# EAGLE design arduino (EAGLE 6.4)
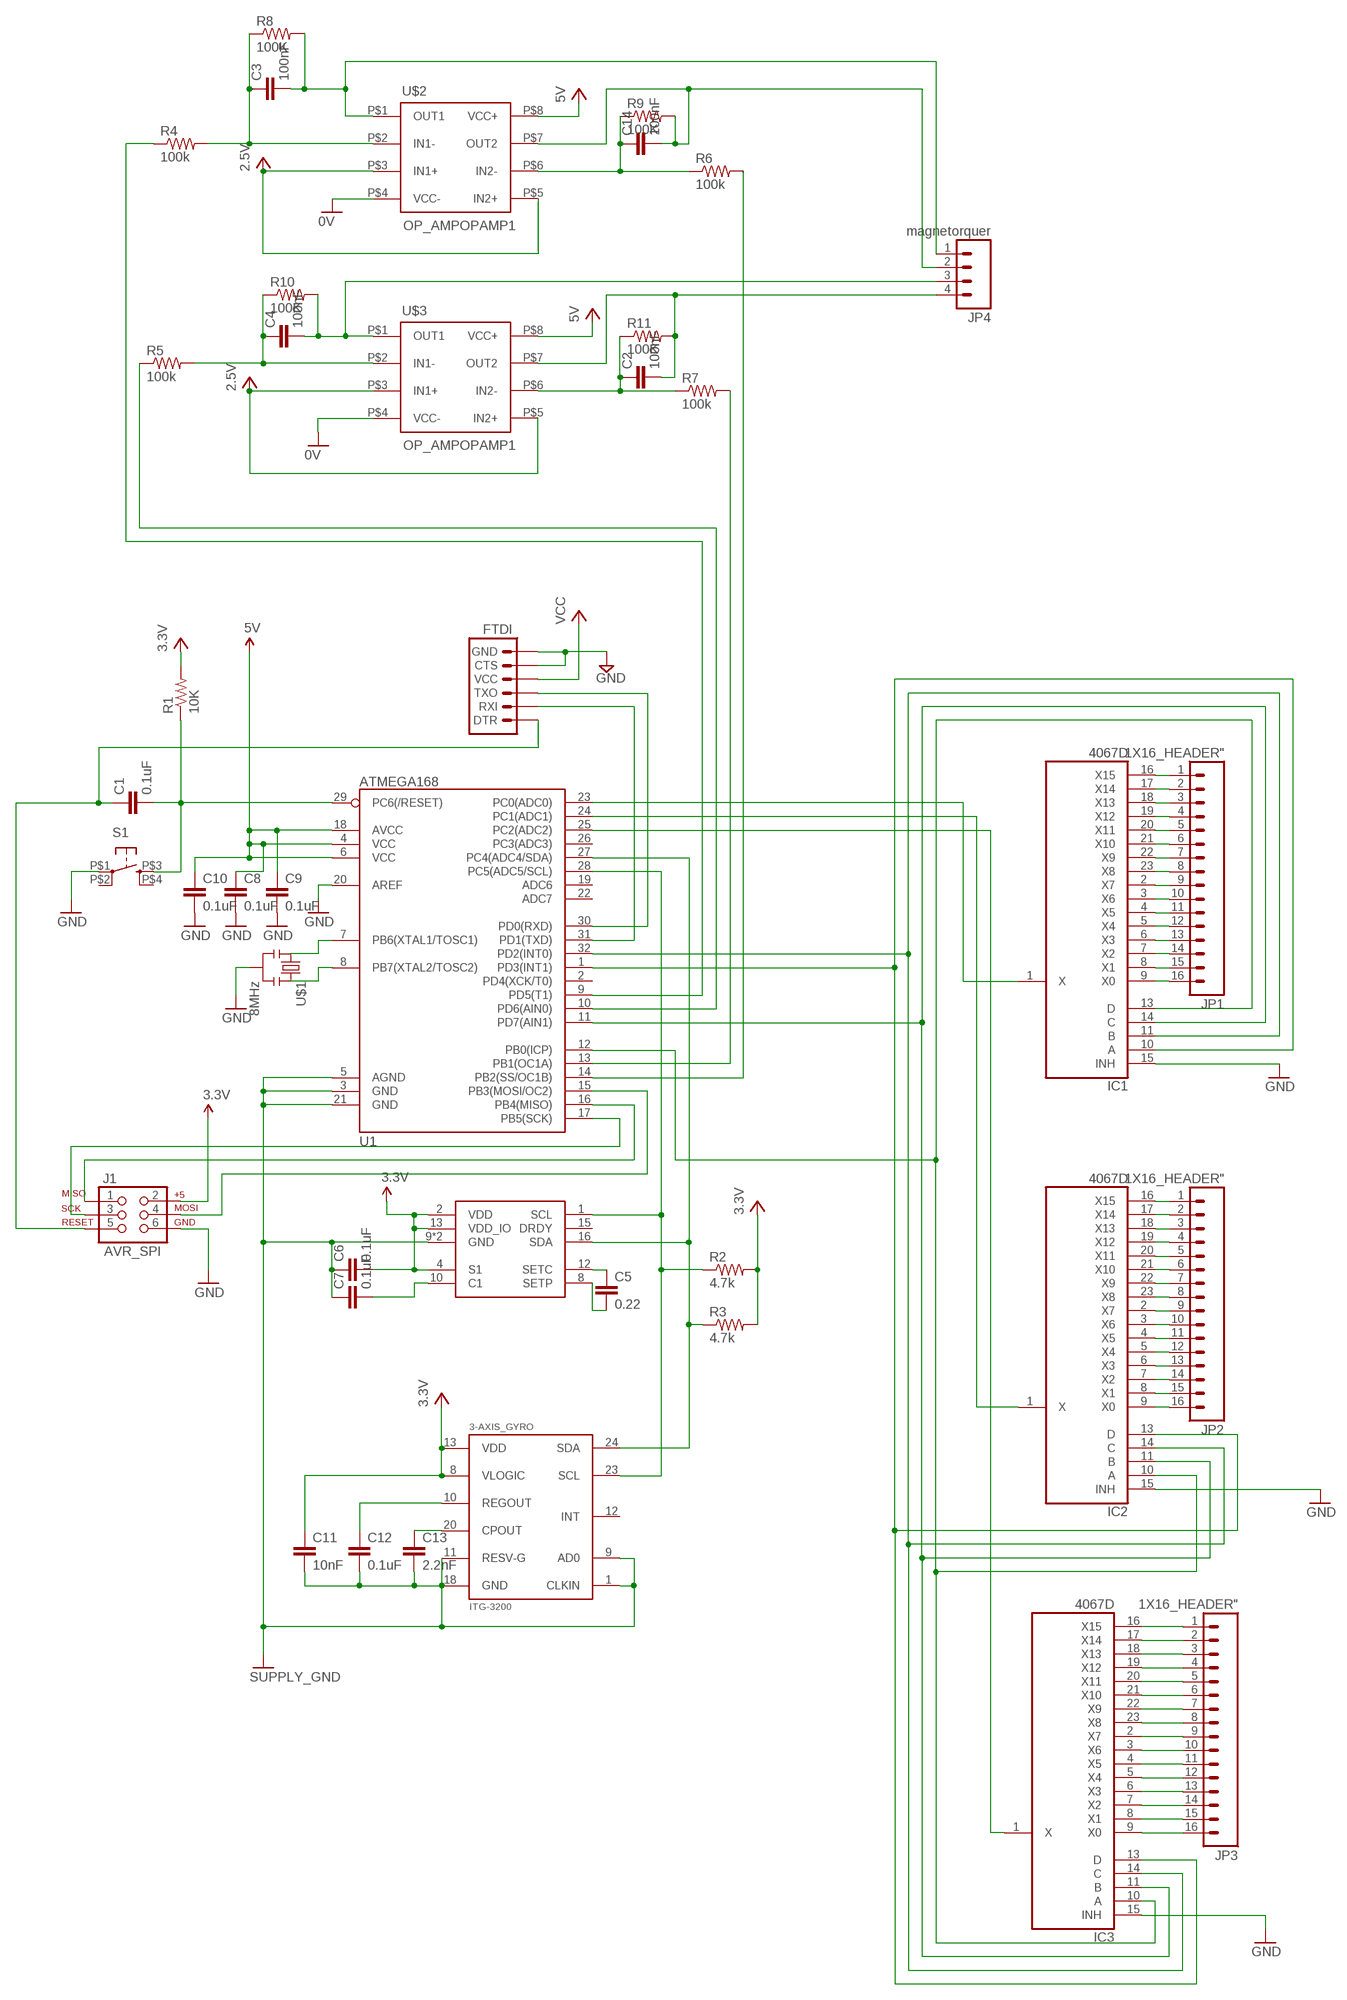
[diagram p0: schematic, sheet 1]

## Parts
3-AXIS_GYRO  ITG-3200  [QFN-24]
3-AXIS_MAG  HMC5883L  [LPCC16]
C1  0.1uF  CAP0603-CAP  [0603-CAP]
C2  100nF  CAP0402-CAP  [0402-CAP]
C3  100nF  CAP0402-CAP  [0402-CAP]
C4  100nF  CAP0402-CAP  [0402-CAP]
C5  0.22  CAP0402-CAP  [0402-CAP]
C6  0.1uF  CAP0402-CAP  [0402-CAP]
C7  0.1uF  CAP0402-CAP  [0402-CAP]
C8  0.1uF  CAP0603-CAP  [0603-CAP]
C9  0.1uF  CAP0603-CAP  [0603-CAP]
C10  0.1uF  CAP0603-CAP  [0603-CAP]
C11  10nF  CAP0402-CAP  [0402-CAP]
C12  0.1uF  CAP0402-CAP  [0402-CAP]
C13  2.2nF  CAP0402-CAP  [0402-CAP]
C14  100nF  CAP0402-CAP  [0402-CAP]
FTDI  ARDUINO_SERIAL_PROGRAMPTH  [1X06]
IC1  4067D  [SO24W]
IC2  4067D  [SO24W]
IC3  4067D  [SO24W]
J1  AVR_SPI  AVR_SPI_PRG_6PTH  [2X3]
JP1  1X16_HEADER"  [1X16_HEADER]
JP2  1X16_HEADER"  [1X16_HEADER]
JP3  1X16_HEADER"  [1X16_HEADER]
JP4  magnetorquer  1X04_HEADER"  [1X04_HEADER]
R1  10K  RESISTOR  [0805]
R2  4.7k  RESISTOR  [0805]
R3  4.7k  RESISTOR  [0805]
R4  100k  RESISTOR  [0805]
R5  100k  RESISTOR  [0805]
R6  100k  RESISTOR  [0805]
R7  100k  RESISTOR  [0805]
R8  100K  RESISTOR  [0805]
R9  100K  RESISTOR  [0805]
R10  100K  RESISTOR  [0805]
R11  100K  RESISTOR  [0805]
S1  TAC_SWITCHKSA_SEALED  [KSA_SEALED_TAC_SWITCH]
U1  ATMEGA168  [TQFP32-08]
U$1  8MHz  RESONATOR"  [RESONATOR]
U$2  OP_AMPOPAMP1  [OPAMP]
U$3  OP_AMPOPAMP1  [OPAMP]

## Nets
GND: 3-AXIS_GYRO.1(CLKIN) 3-AXIS_GYRO.9(AD0) 3-AXIS_GYRO.11(RESV-G) 3-AXIS_GYRO.18(GND) 3-AXIS_MAG.9(GND) 3-AXIS_MAG.11(GND) C6.1 C7.1 C8.2 C9.2 C10.2 C11.2 C12.2 C13.2 FTDI.5(CTS) FTDI.6(GND) IC1.15(INH) IC2.15(INH) IC3.15(INH) J1.6 S1.P$1 U1.3(GND) U1.5(AGND) U1.20(AREF) U1.21(GND) U$1.2 U$2.P$4(VCC-) U$3.P$4(VCC-) ; supply symbol labelled SUPPLY_GND, 0V
N$1: IC1.16(X15) JP1.1
N$2: IC1.14(C) IC2.11(B) IC3.11(B) U1.11(PD7(AIN1))
N$3: IC1.11(B) IC2.14(C) IC3.14(C) U1.32(PD2(INT0))
N$4: IC1.10(A) IC2.13(D) IC3.13(D) U1.1(PD3(INT1))
N$5: IC1.1(X) U1.23(PC0(ADC0))
N$6: IC2.1(X) U1.24(PC1(ADC1))
N$7: IC1.13(D) IC2.10(A) IC3.10(A) U1.12(PB0(ICP))
N$8: IC1.17(X14) JP1.2
N$9: IC1.18(X13) JP1.3
N$10: IC1.19(X12) JP1.4
N$11: IC1.20(X11) JP1.5
N$12: IC1.21(X10) JP1.6
N$13: IC1.22(X9) JP1.7
N$14: IC1.23(X8) JP1.8
N$15: IC1.2(X7) JP1.9
N$16: IC1.3(X6) JP1.10
N$17: IC1.4(X5) JP1.11
N$18: IC1.5(X4) JP1.12
N$19: IC1.6(X3) JP1.13
N$20: IC1.7(X2) JP1.14
N$21: IC1.8(X1) JP1.15
N$22: IC1.9(X0) JP1.16
N$23: IC2.16(X15) JP2.1
N$24: IC2.17(X14) JP2.2
N$25: IC2.18(X13) JP2.3
N$26: IC2.19(X12) JP2.4
N$27: IC2.20(X11) JP2.5
N$28: IC2.21(X10) JP2.6
N$29: IC2.22(X9) JP2.7
N$30: IC2.23(X8) JP2.8
N$31: IC2.2(X7) JP2.9
N$32: IC2.3(X6) JP2.10
N$33: IC2.4(X5) JP2.11
N$34: IC2.5(X4) JP2.12
N$35: IC2.6(X3) JP2.13
N$36: IC2.7(X2) JP2.14
N$37: IC2.8(X1) JP2.15
N$38: IC2.9(X0) JP2.16
N$39: C1.1 FTDI.1(DTR) J1.5
N$40: C1.2 R1.1 S1.P$3 U1.29(PC6(/RESET))
N$41: 3-AXIS_GYRO.23(SCL) 3-AXIS_MAG.1(SCL) R2.1 U1.28(PC5(ADC5/SCL))
N$42: IC3.1(X) U1.25(PC2(ADC2))
N$43: 3-AXIS_GYRO.24(SDA) 3-AXIS_MAG.16(SDA) R3.1 U1.27(PC4(ADC4/SDA))
N$44: 3-AXIS_MAG.12(SETC) C5.1
N$45: 3-AXIS_MAG.8(SETP) C5.2
N$46: IC3.16(X15) JP3.1
N$47: IC3.17(X14) JP3.2
N$48: IC3.18(X13) JP3.3
N$49: IC3.19(X12) JP3.4
N$50: IC3.20(X11) JP3.5
N$51: IC3.21(X10) JP3.6
N$52: IC3.22(X9) JP3.7
N$53: IC3.23(X8) JP3.8
N$54: IC3.2(X7) JP3.9
N$55: IC3.3(X6) JP3.10
N$56: IC3.4(X5) JP3.11
N$57: IC3.5(X4) JP3.12
N$58: IC3.6(X3) JP3.13
N$59: IC3.7(X2) JP3.14
N$60: IC3.8(X1) JP3.15
N$61: IC3.9(X0) JP3.16
N$62: 3-AXIS_MAG.10(C1) C7.2
N$63: R5.1 U1.10(PD6(AIN0))
N$64: 3-AXIS_GYRO.20(CPOUT) C13.1
N$65: 3-AXIS_GYRO.10(REGOUT) C12.1
N$66: C3.2 JP4.1 R8.2 U$2.P$1(OUT1)
N$67: J1.1 U1.16(PB4(MISO))
N$68: J1.3 U1.17(PB5(SCK))
N$69: U1.7(PB6(XTAL1/TOSC1)) U$1.1
N$70: U1.8(PB7(XTAL2/TOSC2)) U$1.3
N$71: J1.4 U1.15(PB3(MOSI/OC2))
N$72: R7.2 U1.13(PB1(OC1A))
N$73: R4.1 U1.9(PD5(T1))
N$75: R6.2 U1.14(PB2(SS/OC1B))
N$76: C4.1 R5.2 R10.1 U$3.P$2(IN1-)
N$77: C14.1 R6.1 R9.1 U$2.P$6(IN2-)
N$78: C2.1 R7.1 R11.1 U$3.P$6(IN2-)
N$79: C4.2 JP4.3 R10.2 U$3.P$1(OUT1)
N$80: FTDI.3(TXO) U1.30(PD0(RXD))
N$81: FTDI.2(RXI) U1.31(PD1(TXD))
N$83: C2.2 JP4.4 R11.2 U$3.P$7(OUT2)
N$84: C3.1 R4.2 R8.1 U$2.P$2(IN1-)
N$85: C14.2 JP4.2 R9.2 U$2.P$7(OUT2)
VCC: 3-AXIS_GYRO.8(VLOGIC) 3-AXIS_GYRO.13(VDD) 3-AXIS_MAG.2(VDD) 3-AXIS_MAG.4(S1) 3-AXIS_MAG.13(VDD_IO) C6.2 C8.1 C9.1 C10.1 C11.1 FTDI.4(VCC) J1.2 R1.2 R2.2 R3.2 U1.4(VCC) U1.6(VCC) U1.18(AVCC) U$2.P$3(IN1+) U$2.P$5(IN2+) U$2.P$8(VCC+) U$3.P$3(IN1+) U$3.P$5(IN2+) U$3.P$8(VCC+) ; supply symbol labelled 3.3V, 5V, 2.5V
Unconnected: 3-AXIS_GYRO.12(INT) 3-AXIS_MAG.15(DRDY) S1.P$2 S1.P$4 U1.2(PD4(XCK/T0)) U1.19(ADC6) U1.22(ADC7) U1.26(PC3(ADC3))

## Power pins joined to a net without a drawn wire
VDD: IC1.24(VDD) IC2.24(VDD) IC3.24(VDD)
VSS: IC1.12(VSS) IC2.12(VSS) IC3.12(VSS)

## Library data of the parts
3-AXIS_GYRO = SparkFun:ITG-3200: ITG-3200 3-axis gyro, digital output, qfn24 package
3-AXIS_MAG = HMC5883L:HMC5883L
C1-C14 = SparkFun:CAP: Capacitor Standard 0603 ceramic capacitor, and 0.1" leaded capacitor.
FTDI = SparkFun:ARDUINO_SERIAL_PROGRAM
IC1-IC3 = 40xx:4067: 16-channel ANALOG MULTIPLEXER
J1 = SparkFun:AVR_SPI_PRG_6: AVR ISP 6 Pin This is the reduced ISP connector for AVR programming. Common on Arduino. This footprint will take up less PCB space and can be used with a 10-pin to 6-pin adapter such as SKU: BOB-08508
JP1-JP3 = RBBB:1X16_HEADER
JP4 = RBBB:1X04_HEADER: Header 4 Standard 4-pin 0.1" header. Use with straight break away headers (SKU : PRT-00116), right angle break away headers (PRT-00553), swiss pins (PRT-00743), machine pins (PRT-00117), and female headers (PRT-00115). Molex polarized connector foot print use with SKU : PRT-08231 with associated crimp pins and housings.
R1-R11 = SparkFun:RESISTOR: Resistor Basic schematic elements and footprints for 0603, 1206, and PTH 1/10th watt (small) resistors.
S1 = SparkFun:TAC_SWITCH: Momentary Switch Button commonly used for reset or general input. Spark Fun Electronics SKU : COM-00097
U1 = SparkFun:ATMEGA168
U$1 = RBBB:RESONATOR: Resonator Small SMD resonator. This is the itty bitty 10/20MHz resonators with built in caps. CSTCE10M0G55 and CSTCE20M0V53. Footprint has been reviewed closely but hasn t been tested yet.'
U$2 U$3 = watsat:OP_AMP

## Board
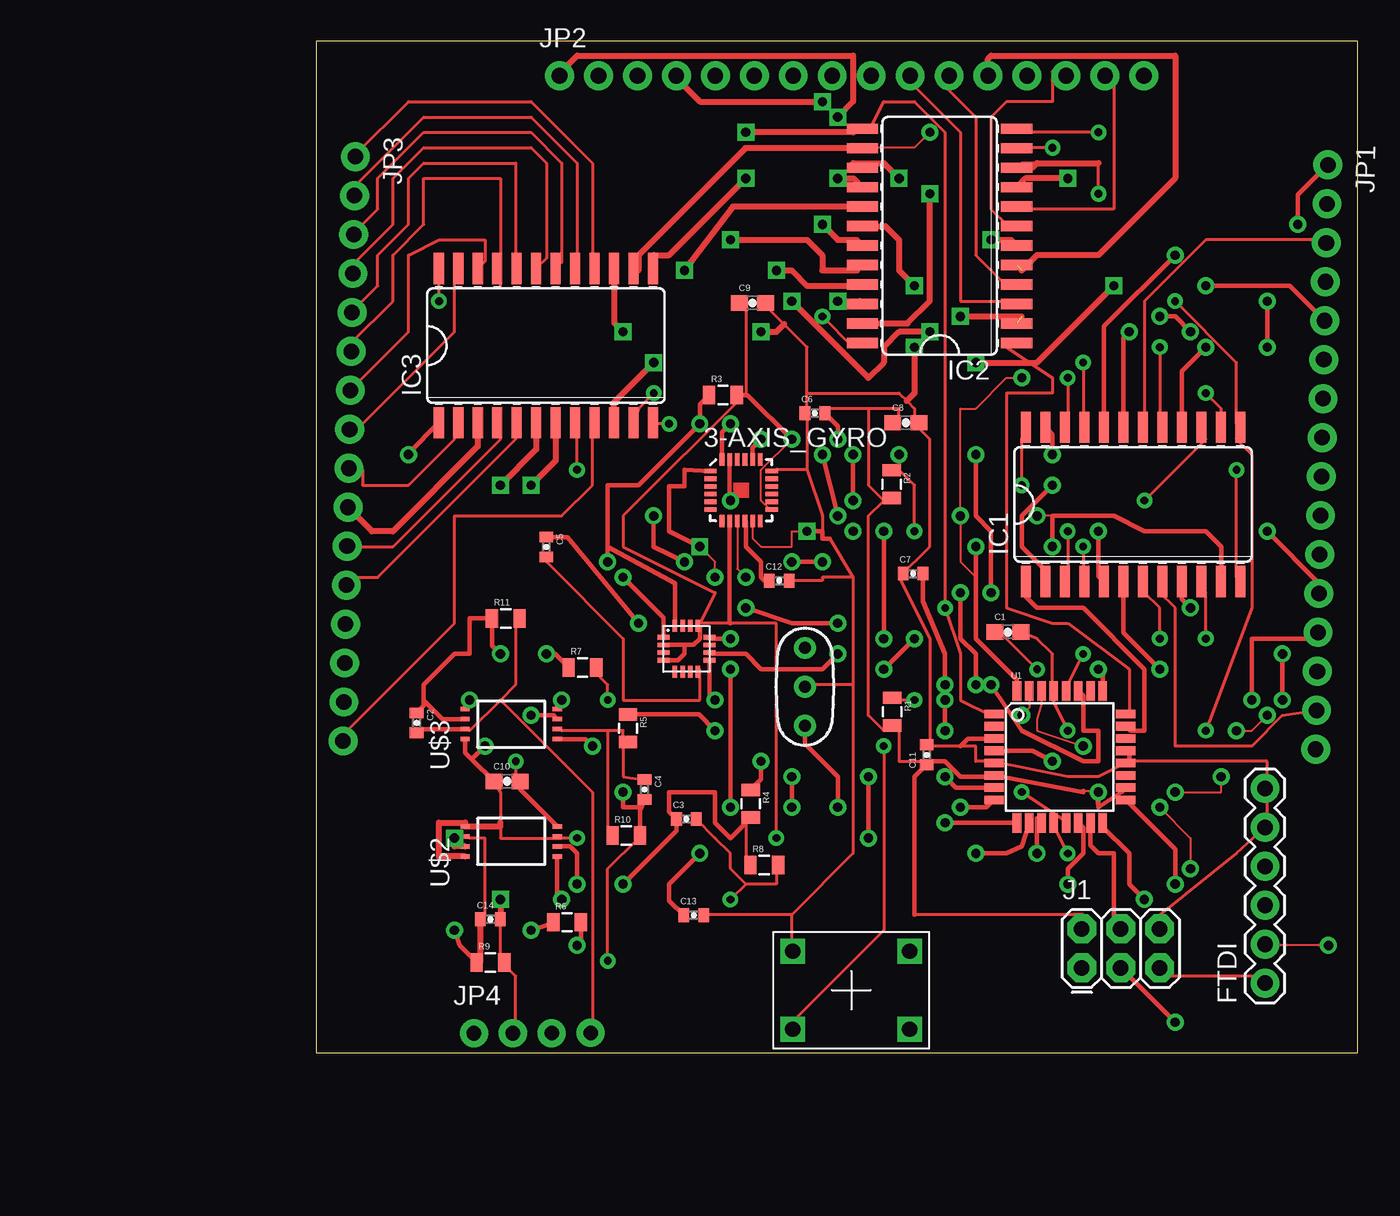
[diagram p1: board, top side]
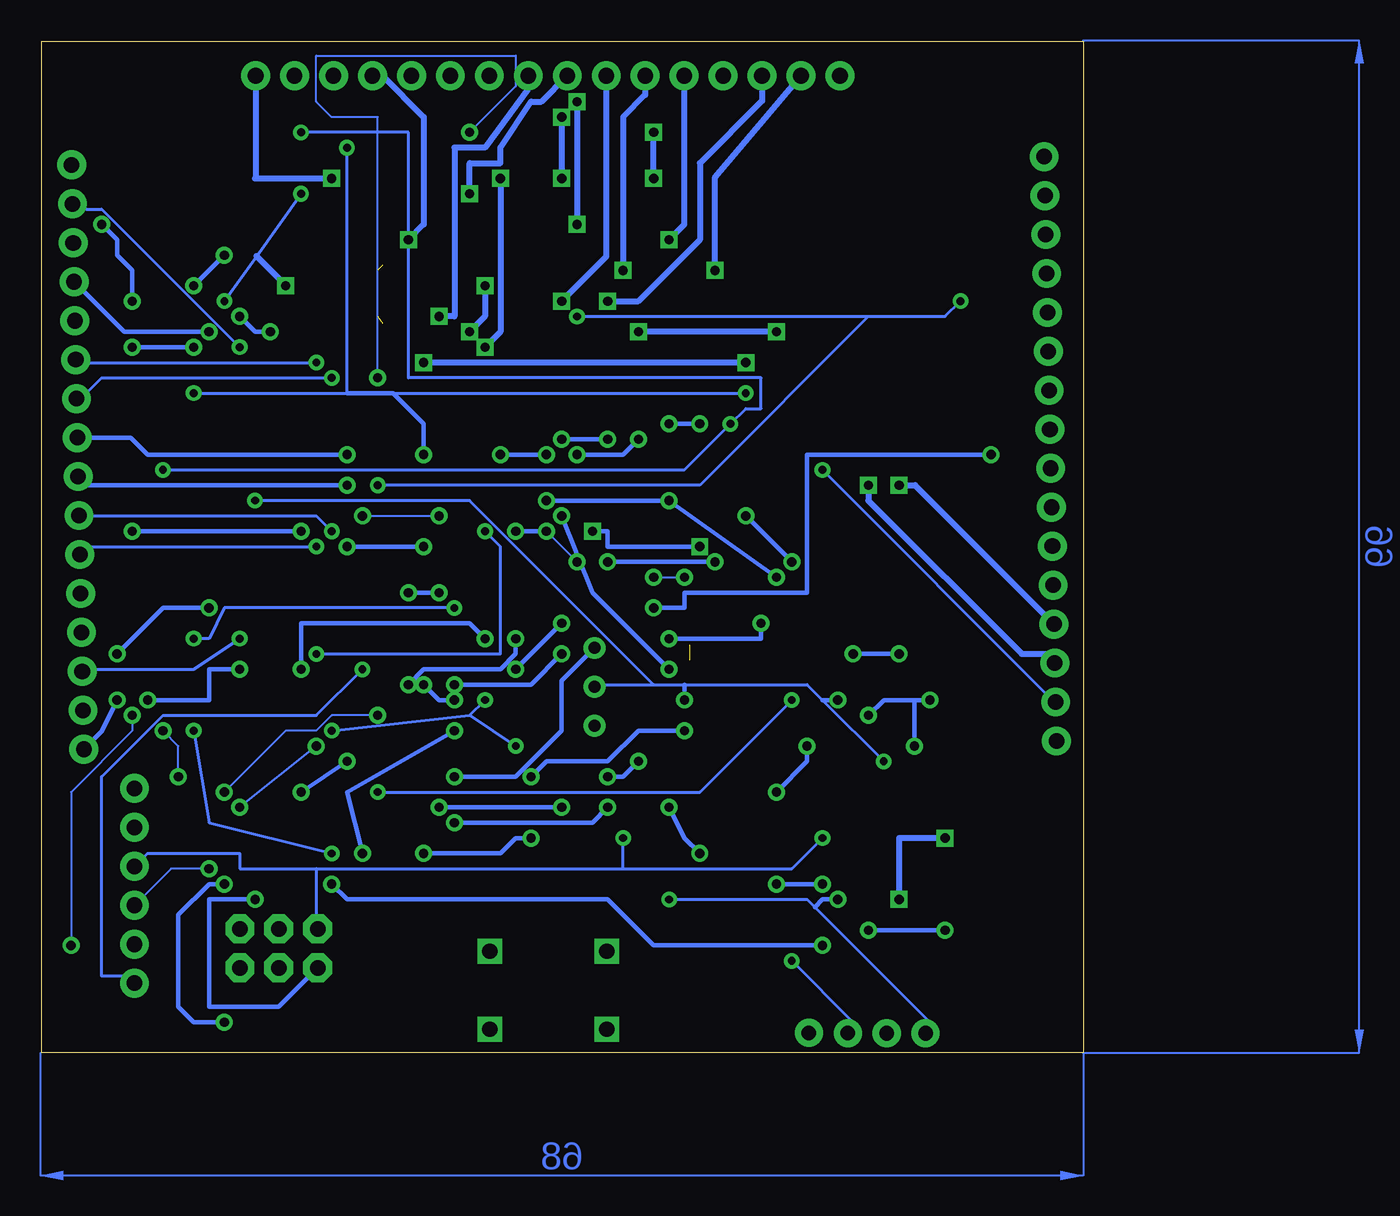
[diagram p2: board, bottom side, seen from below]

Size 67.9 x 65.95 mm. Coordinates in mm from the lower left corner, seen from the top.
Outline: 0,0 67.9,0 67.9,65.95 0,65.95 0,0
Copper layers (1*16): Top 0.035mm / dielectric 1.5mm / Bottom 0.035mm
Design rules "SparkFun *": minimum track width 8mil, minimum drill 20mil, track to track 8mil, track to pad 8mil, pad to pad 8mil, via to via 8mil, smd to smd 8mil, copper to edge 10mil, drill to drill 8mil, minimum pad ring 12mil, minimum via ring 10mil, stop-mask expansion 4mil, vias tented up to drill 25mil, thermal gap 10mil

### Footprints (pad centres in the part's own frame; a part is rotated, then mirrored left to right if it is on the bottom)
QFN-24 = smd 0.8 x 0.3: 1 -2,1.25; 2 -2,0.75; 3 -2,0.25; 4 -2,-0.25; 5 -2,-0.75; 6 -2,-1.25; 13 2,-1.25; 14 2,-0.75; 15 2,-0.25; 16 2,0.25; 17 2,0.75; 18 2,1.25 | smd 0.3 x 0.8: 7 -1.25,-2; 8 -0.75,-2; 9 -0.25,-2; 10 0.25,-2; 11 0.75,-2; 12 1.25,-2; 19 1.25,2; 20 0.75,2; 21 0.25,2; 22 -0.25,2; 23 -0.75,2; 24 -1.25,2
LPCC16 = smd 0.8 x 0.3: 1 -1.5,0.75; 2 -1.5,0.25; 3 -1.5,-0.25; 4 -1.5,-0.75; 9 1.5,-0.75; 10 1.5,-0.25; 11 1.5,0.25; 12 1.5,0.75 | smd 0.3 x 0.8: 5 -0.75,-1.5; 6 -0.25,-1.5; 7 0.25,-1.5; 8 0.75,-1.5; 13 0.75,1.5; 14 0.25,1.5; 15 -0.25,1.5; 16 -0.75,1.5
0603-CAP = smd 1.1 x 1: 1 -0.85,0; 2 0.85,0
0402-CAP = smd 0.7 x 0.9: 1 -0.65,0; 2 0.65,0
1X06 = drill 1.016 pad 1.88: 1 0,0; 2 2.54,0; 3 5.08,0; 4 7.62,0; 5 10.16,0; 6 12.7,0
SO24W = smd 0.66 x 2.032: 1 -6.985,-5.029; 2 -5.715,-5.029; 3 -4.445,-5.029; 4 -3.175,-5.029; 5 -1.905,-5.029; 6 -0.635,-5.029; 7 0.635,-5.029; 8 1.905,-5.029; 9 3.175,-5.029; 10 4.445,-5.029; 11 5.715,-5.029; 12 6.985,-5.029; 13 6.985,5.029; 14 5.715,5.029; 15 4.445,5.029; 16 3.175,5.029; 17 1.905,5.029; 18 0.635,5.029; 19 -0.635,5.029; 20 -1.905,5.029; 21 -3.175,5.029; 22 -4.445,5.029; 23 -5.715,5.029; 24 -6.985,5.029
2X3 = drill 1.016 pad 1.88 octagon: 1 0,0; 2 0,2.54; 3 2.54,0; 4 2.54,2.54; 5 5.08,0; 6 5.08,2.54
1X16_HEADER = drill 1.016 pad 1.88: 1 0,0; 2 2.54,0; 3 5.08,0; 4 7.62,0; 5 10.16,0; 6 12.7,0; 7 15.24,0; 8 17.78,0; 9 20.32,0; 10 22.86,0; 11 25.4,0; 12 27.94,0; 13 30.48,0; 14 33.02,0; 15 35.56,0; 16 38.1,0
1X04_HEADER = drill 0.965 pad 1.829: 1 0,0; 2 2.54,0; 3 5.08,0; 4 7.62,0
0805 = smd 0.8 x 1.2: 1 -0.9,0; 2 0.9,0
KSA_SEALED_TAC_SWITCH = drill 1 square: P$1 -3.81,2.54; P$2 3.81,2.54; P$3 -3.81,-2.54; P$4 3.81,-2.54
TQFP32-08 = smd 1.27 x 0.559: 1 -4.293,2.8; 2 -4.293,2; 3 -4.293,1.2; 4 -4.293,0.4; 5 -4.293,-0.4; 6 -4.293,-1.2; 7 -4.293,-2; 8 -4.293,-2.8; 17 4.293,-2.8; 18 4.293,-2; 19 4.293,-1.2; 20 4.293,-0.4; 21 4.293,0.4; 22 4.293,1.2; 23 4.293,2; 24 4.293,2.8 | smd 0.559 x 1.27: 9 -2.8,-4.293; 10 -2,-4.293; 11 -1.2,-4.293; 12 -0.4,-4.293; 13 0.4,-4.293; 14 1.2,-4.293; 15 2,-4.293; 16 2.8,-4.293; 25 2.8,4.293; 26 2,4.293; 27 1.2,4.293; 28 0.4,4.293; 29 -0.4,4.293; 30 -1.2,4.293; 31 -2,4.293; 32 -2.8,4.293
RESONATOR = drill 0.8: 1 -2.54,0; 2 0,0; 3 2.54,0
OPAMP = smd 0.305 x 0.61: P$1 -0.975,-3; P$2 -0.325,-3; P$3 0.325,-3; P$4 0.975,-3; P$5 0.975,3; P$6 0.325,3; P$7 -0.325,3; P$8 -0.975,3

### Placement (x,y rotation side)
3-AXIS_GYRO  27.7,36.67 0 top
3-AXIS_MAG  24.13,26.34 0 top
C1  45.1,27.43 0 top
C2  6.54,21.51 270 top
C3  24.13,15.24 0 top
C4  21.4,17.16 270 top
C5  14.99,32.97 270 top
C6  32.51,41.69 0 top
C7  38.91,31.24 0 top
C8  38.43,41.07 0 top
C9  28.43,48.88 0 top
C10  12.43,17.69 0 top
C11  39.8,19.43 90 top
C12  30.18,30.78 0 top
C13  24.61,8.97 0 top
C14  11.35,8.7 0 top
FTDI  61.86,4.54 90 top
IC1  53.26,35.75 0 top
IC2  40.64,53.26 90 top
IC3  14.97,46.1 0 top
J1  49.91,5.54 0 top
JP1  65.96,57.88 268.8 top
JP2  15.86,63.69 0 top
JP3  2.54,58.42 268.8 top
JP4  10.27,1.27 0.2 top
R1  37.56,22.24 270 top
R2  37.51,37.07 270 top
R3  26.51,42.88 0 top
R4  28.32,16.24 270 top
R5  20.32,21.16 270 top
R6  16.35,8.51 0 top
R7  17.35,25.13 0 top
R8  29.21,12.24 0 top
R9  11.35,5.89 0 top
R10  20.21,14.16 0 top
R11  12.35,28.32 0 top
S1  34.88,4.08 0 top
U1  48.48,19.29 0 top
U$1  31.86,23.86 270 top
U$2  12.7,13.78 90 top
U$3  12.7,21.43 90 top

### Tracks (layer width: path | path; a pad name or v marks a point on that pad's centre or on a via)
GND  (via drill 0.51, 0.6)  (1 unrouted)
  Top 0.14: 3-AXIS_GYRO.9 27.45,31.55 v28,31 | v26,31 26,32 v25,33 | 3-AXIS_GYRO.11 28.45,33.55 29,33 31,33 31,34 v32,34
  Top 0.203: v13,19 13,18 C10.2 | v54,36 58,40 IC1.15 | 40,20 40,27 38,31 | 39,41 40,40 40,33 38,31 | 38,31 C7.1 | 53,19 51,18 49,18 44,19 | J1.6 55,9 60,13 FTDI.5 62,15 62,17 FTDI.6 62,18 62,19 53,19 | 53,19 U1.20 | 40,20 42,20 43,20 43,19 44,19 | 40,20 C11.2 | 44,19 U1.5 | 31,9 25,9 C13.2 | 31,9 31,7 S1.P$1 | 32,39 32,38 | 32,38 30,38 3-AXIS_GYRO.18 | 32,42 32,39 | 33,34 33,35 32,38 | 32,39 32,38 | 32,42 32,43 | 32,43 32,46 30.5,47.5 29,49 C9.2 | 32,42 C6.1 | 35,58 IC2.15 | 31,9 35,13 35,24 | 35,31 35,24 | 35,31 33,31 33,30.78 C12.2 | 39,41 39,42 38.5,42.5 38,43 32,43 | 39,41 C8.2 | 35,24 32,24 U$1.2 | 33.5,33.5 35,31
  Top 0.3: U$3.P$4 15.7,22.7 v16,23 | C10.2 13.28,17.18 U$2.P$4 | U1.3 42.49,20.49 42,20 | 53,19 53,19.46 U1.21 | 3-AXIS_MAG.9 25.63,23.37 v26,23
  Top 0.305: 3-AXIS_GYRO.1 24,38 24,36.92 23,36.92 23,34 v25,33 | v32,34 33,34 33,33.5 33.5,33.5
  Top 0.406: IC3.15 19.41,47.59 v20,47 | v29,47 30,47 30.5,47.5 | 35,58 37,58 v38,57 | v39,46 39,43 38.5,42.5
  Bottom 0.14: v28,31 v26,31
  Bottom 0.203: v13,19 17,23 18,24 26,24 28,24 | 28,24 32,24 U$1.2 | v54,36 40,36 28,24
  Bottom 0.3: v16,23 17,23 | v26,23 26,24
  Bottom 0.305: v25,33 31,33 31,34 v32,34
  Bottom 0.406: v20,47 v29,47 | v38,57 38,47 v39,46
N$1  (via drill 0.6)
  Top 0.3: IC1.16 56.44,44.44 v58,46 | v62,46 v62,49 | v64,54 64,55.92 JP1.1
  Bottom 0.3: v58,46 v62,46 | v62,49 62,51 63,52 63,53 v64,54
N$2  (via drill 0.51, 0.6)
  Top 0.203: v22,43 21,42 IC3.11 | v58,43 59,42 59,41 IC1.14 | v48,59 46,59 IC2.11
  Top 0.3: v43,39 43,35 44,34 v44,30 | v42,30 42,27 43,26 v43,24 | v41,23 v41,21 | v47,13 47,15.28 U1.11
  Bottom 0.203: v58,43 48,43 | 48,43 v22,43 | 48,43 v48,59
  Bottom 0.3: 48,43 45,43 43,41 v43,39 | v44,30 v42,30 | v43,24 42,23 v41,23 | v41,21 48,17 v47,13
N$3  (via drill 0.6)
  Top 0.14: 48,35 v47,35 | 43,31 42,32 v42,35 42,42 43,42 45,44 v46,44 | v40,60 39,59 35.64,59 IC2.14
  Top 0.3: U1.32 45.68,24.32 43,27 43,31 v43,33 | v48,33 48,35 52,35 54,34 58,34 59,33 59,30 58.98,30.02 IC1.11
  Top 0.406: IC2.14 27.98,58.98 21,52 21,51 20.81,51 IC3.14
  Bottom 0.14: v47,35 v42,35 | v46,44 46,61 49,61 50,62 50,65 37,65 37,63 v40,60
  Bottom 0.3: v43,33 v48,33
N$4  (via drill 0.51, 0.6)
  Top 0.203: U1.1 44,22 42,23 42,26 v41,29 41,60 39,62 37,62 36,60 IC2.13 35,60 | 22,52 IC3.13 | v58,27 58,30 IC1.10
  Top 0.406: 35,60 v28,60 | 22,52 23,52 v28,57
  Bottom 0.203: v41,29 56,29 57,27 v58,27
  Bottom 0.406: v28,57 v28,60
N$5
  Top 0.3: IC1.1 46.27,29.73 47,29 50,29 54,25 54,21 53.06,21 U1.23
N$6
  Top 0.203: U1.24 53,22 53,25 49,28 48,28 45,29 45,43 48,43 48,44 45,46 IC2.1
N$7  (via drill 0.51, 0.6)
  Top 0.203: v49,13 48,15 U1.12 | v58,21 61,29 61,39 60,40 IC1.13 60,41 60,45 v56,49 | 47,58 46,58 IC2.10 | v51,56 51,58
  Top 0.406: IC2.10 46.7,57.7 47,58 51,58 | IC3.10 19.41,42.41 v22,45 | v43,45 47,45 v52,50
  Bottom 0.203: v58,21 57,15 v49,13 | v56,49 53.91,51.93 v51,56
  Bottom 0.406: v22,45 v43,45 | v52,50 52,50.03 53.91,51.93
N$8  (via drill 0.51)
  Top 0.203: v55,46 55,41 IC1.17
  Bottom 0.203: v55,46 64,55 65,55 JP1.2
N$9
  Top 0.203: IC1.18 54,41 54,49 58,53 65,53 JP1.3
N$10  (via drill 0.6)
  Top 0.3: IC1.19 52.62,46.62 v53,47 | v55,48 56,48 v57,47
  Bottom 0.3: v53,47 54,47 v55,48 | v57,47 62.54,47 JP1.4
N$11  (via drill 0.6)
  Top 0.3: IC1.20 51.35,47.35 v56,52 | v58,50 63.47,50 JP1.5
  Bottom 0.3: v56,52 v58,50
N$12  (via drill 0.51)
  Top 0.203: v50,45 50,41 IC1.21
  Bottom 0.203: v50,45 65,45 JP1.6
N$13  (via drill 0.51)
  Top 0.203: v49,44 49,41 IC1.22
  Bottom 0.203: v49,44 64,44 65,43 JP1.7
N$14  (via drill 0.6)
  Top 0.3: v48,39 48,40.32 IC1.23
  Bottom 0.3: JP1.8 62.1,40.1 61,39 v48,39
N$15  (via drill 0.6)
  Top 0.3: IC1.2 47.55,31.45 46,33 46,35 v48,37
  Bottom 0.3: v48,37 64.97,37 JP1.9
N$16  (via drill 0.51)
  Top 0.203: v49,34 49,31 IC1.3
  Bottom 0.203: v49,34 50,35 65,35 JP1.10
N$17  (via drill 0.51)
  Top 0.203: v50,33 50,31 IC1.4
  Bottom 0.203: v50,33 65,33 JP1.11
N$18  (via drill 0.6)
  Top 0.3: JP1.12 65.38,30.62 v62,34 | v51,34 51,31.08 IC1.5
  Bottom 0.3: v62,34 v51,34
N$19  (via drill 0.6)
  Top 0.3: IC1.6 52.62,27.38 v55,25 | v61,23 61,27 64.92,27 JP1.13
  Bottom 0.3: v55,25 57,25 57,23 v61,23
N$20  (via drill 0.51)
  Top 0.203: v55,27 55,29 54,30 IC1.7
  Bottom 0.203: v55,27 58,25 65,25 JP1.14
N$21
  Top 0.203: IC1.8 55,30 56,29 56,20 61,20 63,22 JP1.15
N$22  (via drill 0.6)
  Top 0.3: IC1.9 56.44,29.57 v57,29 | v63,26 v63,23
  Bottom 0.3: v57,29 60,29 v63,26 | v63,23 64,20.95 JP1.16
N$23  (via drill 0.6)
  Top 0.406: JP2.1 15.86,63.86 17,65 35,65 35,62 v34,61 | v34,57 35.05,57 IC2.16
  Bottom 0.406: v34,61 v34,57
N$24  (via drill 0.6)
  Top 0.406: IC2.17 27.16,55.16 v24,51
  Bottom 0.406: v24,51 24,57.09 JP2.2
N$25  (via drill 0.6)
  Top 0.406: IC2.18 37.1,53.9 38,53 38,51 v39,50 | v40,47 38,47 37,46 37,45 36,44 v31,49
  Bottom 0.406: JP2.3 20.94,62.06 25,58 25,53 29,49 v31,49 | v39,50 39,48 v40,47
N$26  (via drill 0.6)
  Top 0.406: JP2.4 23.48,63.52 25,62 v33,62 | v33,54 34,53 35.24,53 IC2.19
  Bottom 0.406: v33,62 v33,54
N$27  (via drill 0.6)
  Top 0.406: v27,53 32,53 33,52 33,51 35.26,51 IC2.20
  Bottom 0.406: JP2.5 26.02,53.98 v27,53
N$28  (via drill 0.6)
  Top 0.406: v30,51 31,51 32,50 35.53,50 IC2.21
  Bottom 0.406: JP2.6 28.56,62.44 30,61 v30,51
N$29  (via drill 0.6)
  Top 0.406: v34,49 35.43,49 IC2.22
  Bottom 0.406: JP2.7 31.1,51.9 v34,49
N$30  (via drill 0.6)
  Top 0.406: IC2.23 38.55,47.55 40,49 v40,56
  Bottom 0.406: v40,56 40,58 38,58 38,59 36,62 35.33,62 JP2.8
N$31  (via drill 0.6)  (1 unrouted)
  Top 0.406: v42,48 46,48
  Bottom 0.406: JP2.9 36.18,62.82 39,59 41,59 41,48 v42,48
N$32
  Top 0.203: IC2.3 45,49 42,49 42,60 39,63 JP2.10
N$33
  Top 0.203: IC2.4 45,50 43,52 43,61 41,63 JP2.11
N$34  (1 unrouted)
  Top 0.406: JP2.12 43.8,64.8 44,65 56,65 56,57 51,52 47,52 46,51
N$35  (via drill 0.6)
  Top 0.406: v44,53 45.29,53 IC2.6
  Bottom 0.406: JP2.13 45.69,63.69 43,61 43,54 v44,53
N$36
  Top 0.203: IC2.7 45,54 44,55 44,61 45,62 48,62 48,64 JP2.14
N$37
  Top 0.203: IC2.8 46,55 52,55 52,63 JP2.15
N$38  (via drill 0.6)
  Top 0.406: v49,57 46.23,57 IC2.9
  Bottom 0.406: JP2.16 53.96,57.04 54,57 v49,57
N$39  (via drill 0.51)
  Top 0.203: v47,25 45,27 C1.1 | J1.5 55,5 61,5 FTDI.1
  Bottom 0.203: v47,25 50,22 60,22 64,18 64,5 62,5 FTDI.1
N$40  (via drill 0.51)
  Top 0.203: C1.2 47,27 48,26 48,24 U1.29 48,23 v49,21 | v39,23 38,23 R1.1 | v37,20 37,8 31,2 S1.P$3
  Bottom 0.203: 40,22 v39,23 | v49,21 40,22 | 40,22 v37,20
N$41  (via drill 0.51, 0.6)
  Top 0.203: v39,34 39,37 38,38 R2.1 | v50,26 49,24 U1.28
  Top 0.3: 3-AXIS_GYRO.23 26.95,36.05 v27,36 | v35,36 v35,39 | v38,39 38,38 | 3-AXIS_MAG.1 22.63,28.37 v20,31
  Bottom 0.203: v39,34 38,33 38,26 v50,26
  Bottom 0.3: v35,36 v27,36 v20,31 | v35,39 v38,39
N$42  (via drill 0.6)
  Top 0.3: U1.25 51.28,24.72 v51,25 | v39,27 v37,25 | v34,28 31,28 v28,29 | v6,39 6,39.09 IC3.1
  Bottom 0.3: v51,25 51,28 40,28 v39,27 | v37,25 v34,28 | v28,29 26,29 26,30 18,30 18,39 v6,39
N$43  (via drill 0.6)
  Top 0.3: 3-AXIS_GYRO.24 26.45,40.45 v27,41 | R3.1 25,42.27 v25,41 21,37 19,37 19,33 | 3-AXIS_MAG.16 23.38,30.62 19,33 | 19,33 v19,32 | v22,35 22,33 v24,32 | v31,32 v33,32 | v37,34 v37,27 | v44,24 46,21 50,19 51,19 51,21 50,21 50,23.26 U1.27
  Bottom 0.14: v33,32 v35,34
  Bottom 0.3: v27,41 v25,41 | v19,32 v22,35 | v24,32 v31,32 | v35,34 v37,34 | v37,27 37,26 38,25 43,25 v44,24
N$44  (via drill 0.6)
  Top 0.3: C5.1 16.38,33.62 v21,28 | v27,27 25.72,27 3-AXIS_MAG.12
  Bottom 0.3: v21,28 21,27 v27,27
N$45
  Top 0.203: 3-AXIS_MAG.8 25,25 25,23 20,23 20,27 15,32 C5.2
N$46
  Top 0.2: JP3.1 2.54,58.54 6,62 14,62 18,58 18,51.27 IC3.16
N$47
  Top 0.2: JP3.2 2.49,56.49 7,61 14,61 17,58 17,51.25 IC3.17
N$48
  Top 0.2: JP3.3 2.43,53.43 4,55 4,57 7,60 14,60 16,58 16,51.52 IC3.18
N$49
  Top 0.2: JP3.4 2.38,51.38 5,54 5,57 7,59 14,59 15,58 15,51.79 IC3.19
N$50
  Top 0.2: JP3.5 2.33,48.33 4,50 4,52 6,54 6,57 7,58 13,58 13,51.19 IC3.20
N$51
  Top 0.2: JP3.6 2.27,46.27 5,49 5,52 7,54 7,57 12,57 12,50.92 | 12,50 12,50.92 | 12,50.92 IC3.21
N$52
  Top 0.2: JP3.7 2.22,43.22 6,47 6,52 8,53 11,53 11,51.6 IC3.22
N$53
  Top 0.203: IC3.23 9,51 9,47 3,41 JP3.8
N$54
  Top 0.203: IC3.2 9,41 9,40 6,37 3,37 3,38 JP3.9
N$55
  Top 0.406: IC3.3 10.53,39.52 5,34 3.63,34 JP3.10
N$56
  Top 0.203: IC3.4 12,41 12,40 5,33 2,33 JP3.11
N$57
  Top 0.203: IC3.5 13,41 13,40 4,31 2,31 JP3.12
N$58  (via drill 0.6)
  Top 0.406: IC3.6 14.34,39.34 v12,37
  Bottom 0.406: v12,37 10.96,37 JP3.13
N$59  (via drill 0.6)
  Top 0.406: IC3.7 15.61,38.6 v14,37
  Bottom 0.406: v14,37 14,36 4,26 2.44,26 JP3.14
N$60  (via drill 0.51)
  Top 0.203: v17,38 17,41 IC3.8
  Bottom 0.203: v17,38 2,23 JP3.15
N$61
  Top 0.203: IC3.9 18,41 18,37 16,35 9,35 9,28 2,21 JP3.16
N$62  (via drill 0.6)
  Top 0.3: C7.2 39.56,29.44 41,26 v41,24 | v34,26 33,25 29,25 28,26 25.72,26 3-AXIS_MAG.10
  Bottom 0.3: v41,24 36,24 v34,26
N$63  (via drill 0.6)
  Top 0.3: R5.1 24.94,22.06 v26,21 | v36,18 v36,14 | v43,13 45,13 46,13.48 U1.10
  Bottom 0.3: v26,21 29,21 31,19 35,19 v36,18 | v36,14 37,14 38,13 v43,13
N$64  (via drill 0.6)
  Top 0.3: 3-AXIS_GYRO.20 28.45,39.45 v29,40 | v33,39 v34,35 | v27,25 v27,16 | v25,13 23,11 23,9.93 C13.1
  Bottom 0.3: v29,40 30,39 v33,39 | v34,35 32,30 v27,25 | v27,16 26,14 v25,13
N$65
  Top 0.3: C12.1 29.22,30.78 29,31 29,32 28,33 28,34.62 3-AXIS_GYRO.10
N$66  (via drill 0.51, 0.6)
  Top 0.203: 28,11 27,12 27,13 26,14 C3.2 | 28,11 30,11 30,12 R8.2 | 28,11 v27,10
  Top 0.3: U$2.P$1 15.7,10.3 v16,10
  Bottom 0.203: v27,10 18,10 17.5,9.5 10,2 JP4.1
  Bottom 0.3: v16,10 17,10 17.5,9.5
N$67  (via drill 0.6)
  Top 0.3: U1.16 51.28,14.72 53,13 53,11 v54,10
  Bottom 0.3: v54,10 57,10 57,3 52.45,3 J1.1
N$68  (via drill 0.6)
  Top 0.3: J1.3 v56,2 | v56,11 56,13.26 U1.17
  Bottom 0.3: v56,2 58,2 59,3 59,9 57,11 v56,11
N$69  (via drill 0.6)
  Top 0.3: U1.7 41.71,17.29 v41,18
  Bottom 0.3: v41,18 37,18 34,21 34,24.26 U$1.1
N$70  (via drill 0.6)
  Top 0.3: U$1.3 31.86,20.14 34,18 v34,16 | v42,16 43.7,16 U1.8
  Bottom 0.3: v34,16 v42,16
N$71
  Top 0.3: U1.15 50.48,13.52 51,13 52,13 52,8.53 J1.4
N$72  (via drill 0.51)
  Top 0.203: v19,23 19,24 18,25 R7.2 | v46,17 49,15 U1.13
  Bottom 0.203: v19,23 25,17 v46,17
N$73  (via drill 0.6)
  Top 0.3: U1.9 v41,15 | v31,16 v31,18 | v29,19 29,17.82 R4.1
  Bottom 0.3: v41,15 32,15 v31,16 | v31,18 30,18 v29,19
N$75  (via drill 0.6)
  Top 0.3: R6.2 17.25,7.25 v17,7 | v49,11 49,12 50,13 50,14.68 U1.14
  Bottom 0.3: v17,7 28,7 31,10 48,10 v49,11
N$76
  Top 0.203: 19,21 20,21 20,20 | 19,21 16,21 U$3.P$2 | 20,20 20,18 C4.1 | 20,20 R5.2 | 19,21 19,14 R10.1
N$77  (via drill 0.6)
  Top 0.203: U$2.P$6 10,14 11,14 11,9 C14.1
  Top 0.3: R6.1 15.45,8.45 v14,8 | v9,8 9.34,7 R9.1
  Top 0.406: R9.1 10.7,5.89 C14.1
  Bottom 0.3: v14,8 v9,8
N$78  (via drill 0.6)
  Top 0.3: 7,23 7,24 9,26 10,26 10,28.32 R11.1 11.45,26.55 v12,26 | 7,23 7,22.62 C2.1 | U$3.P$6 8.24,21.75 7,23 | v15,26 15.58,26 R7.1
  Bottom 0.3: v12,26 v15,26
N$79  (via drill 0.51, 0.6)
  Top 0.203: v19,6 19,12 21,14 R10.2
  Top 0.3: R10.2 21.11,15.8 21.16,15.93 | 21.16,15.93 C4.2 | U$3.P$1 17.55,20.45 v18,20 | v20,17 20,16 21.1,16 21.16,15.93
  Bottom 0.203: v19,6 15,2 JP4.3
  Bottom 0.3: v18,20 18,19 v20,17
N$80  (via drill 0.6)
  Top 0.14: U1.30 47.28,22.72 47,21.72 47,21 v50,20 | v55,16 57,14 v57,12
  Bottom 0.14: v50,20 v55,16 | v57,12 59.48,12 FTDI.3
N$81  (via drill 0.6)
  Top 0.14: U1.31 46.48,22.48 v46,22 | v56,17 59,17 v59,18 | v60,21 61,21 v62,22 | v66,7 61.94,7 FTDI.2
  Bottom 0.14: v46,22 49,22 50,21 52,21 v56,17 | v59,18 59,20 v60,21 | v62,22 62,21 66,17 v66,7
N$83
  Top 0.203: 12,23 13,24 13,28 R11.2 | 12,23 10,21 U$3.P$7 | 12,23 18,17 18,2 JP4.4
  Top 0.3: U$3.P$7 6.79,21.11 C2.2
N$84  (via drill 0.6)
  Top 0.203: R8.1 28,12 28,15 R4.2
  Top 0.3: v20,11 23.48,14.48 C3.1 23,15.72 23,17 26,17 26,15 27,14 28,15 | U$2.P$2 16.55,13.46 17,13 v17,11
  Bottom 0.3: v20,11 v17,11
N$85  (via drill 0.6)
  Top 0.203: 12,6 C14.2 12,9 | 12,6 13,5 13,2 JP4.2 | 12,6 R9.2
  Top 0.406: U$2.P$7 9,13.46 v9,14 | v12,10 C14.2
  Bottom 0.406: v9,14 12,14 v12,10
VCC  (via drill 0.51, 0.6)
  Top 0.14: 50,17.09 50.91,17.09 | 3-AXIS_GYRO.13 29.58,35.42 29,36 29,38 v31,40
  Top 0.203: 36,42 38,42 38,41 C8.1 | 36,42 33,42 C6.2 | 37,36 36,37 36,42 | 44,18 U1.6 | C11.1 40,19 38,19 38,21 R1.2 37,21 36,22 36,35 37,36 | 37,36 R2.2 | 25,28 26,30 20,33 20,35 28,43 28,49 C9.1 | 16,14 12,14 12,15 12,17 C10.1 | v17,14 16,14 | 16,14 U$2.P$3 | 25,28 27,28 30,28 v30,14 | 25,28 3-AXIS_MAG.13 | 39,9 50,9 J1.2
  Top 0.3: U$3.P$5 9.7,22.7 v10,23 | U$3.P$8 9.7,19.57 10.13,19.14 | 10.13,19.14 C10.1 | v11,20 10.13,19.14 | v14,22 15.46,22 U$3.P$3 | R3.2 28.12,42.88 v31,40 | v34,40 34,40.85 C6.2 | 50,17.09 50,17 U1.6 44.1,18 42,18 41,19 40,19 39,18 39,9 | 50.91,17.09 51,16 | 51,16 52.48,17 U1.18 | U1.4 46.69,19.69 v48,19 | v51,17 51,16 | 3-AXIS_GYRO.8 26.95,28.05 27,28 | 3-AXIS_MAG.2 24,26.59 | 24,26.59 24.59,26.59 25,27 25,27.72 3-AXIS_MAG.13 | 3-AXIS_MAG.4 23.59,25.59 24,26 24,26.59
  Top 0.406: U$2.P$8 8,12.8 8,15 9.7,15 U$2.P$5 12,14.76 12,15
  Bottom 0.203: v17,14 19,12 30,12 | 50,12 55,12 55,13 61,13 FTDI.4 | 50,12 30,12 | 50,12 50,9 J1.2 | 30,12 v30,14
  Bottom 0.3: v10,23 11,23 | 11,23 v11,20 | 11,23 13,23 v14,22 | v31,40 v34,40 | v48,19 v51,17
VDD  (via drill 0.51)
  Top 0.203: v8,49 8,51 IC3.24 | v33,48 35,46 IC2.24 | v46,37 46,40 IC1.24
  Bottom 0.203: v8,49 9,48 14,48 | v33,48 14,48 | v46,37 25,37 14,48
VSS  (via drill 0.51)
  Top 0.203: v23,41 22,41 IC3.12 | v60,38 60,31 IC1.12 | v51,60 46,60 IC2.12
  Bottom 0.203: v60,38 26,38 v23,41 22,42 21,42 21,44 44,44 44,60 v51,60
(copper drawn outside any net)
  shapes: Bottom area x2